# Altium schematic sheet microUSB.SchDoc
size A; SheetNumber: 9; SheetTotal: 12
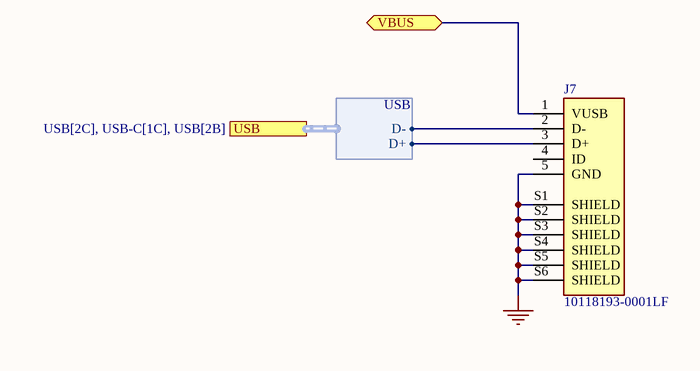
[diagram p0: microUSB.SchDoc]

## Parts
J7  10118193-0001LF  [AMPHENOL_10118193-0001LF]

## Ports
USB (harness USB, see USB[2C], USB-C[1C], USB[2B]), VBUS (bidir)

## Harnesses
USB: D-, D+

## Nets
GND: J7.5(GND) J7.S1(SHIELD) J7.S2(SHIELD) J7.S3(SHIELD) J7.S4(SHIELD) J7.S5(SHIELD) J7.S6(SHIELD)
VBUS: J7.1(VUSB) ; port VBUS
NetJ7_2: J7.2(D-) ; port USB.D-
NetJ7_3: J7.3(D+) ; port USB.D+

Not connected (* = marked no-connect by the designer): J7 4(ID)

## Library data of the parts
J7 = CMP-020-000000-2: Micro USB 2.0, Input Output Connectors, B TYPE RECEPTACLE; MF: Amphenol ICC; Check_prices: https://www.snapeda.com/parts/10118193-0001LF/Amphenol+FCI/view-part/?ref=eda; Value: *; Package: None; Source: 10118193-0001LF.SchLib; Price: None; Design Item ID: 10118193-0001LF; Pin Count: 11; Availability: In Stock; SnapEDA_Link: https://www.snapeda.com/parts/10118193-0001LF/Amphenol+FCI/view-part/?ref=snap; Purchase-URL: https://pricing.snapeda.com/search/part/10118193-0001LF/?ref=eda; Component Type: Standard; MP: 10118193-0001LF